# Altium schematic sheet 1_P1.schdoc
size 309 x 223 mm; Symbol: Sheet-Symbol_A4; Device: Sheet-Symbol_A4; @Page Name: P1; @Create Date: 2023-06-01; @Page Count: 1; @Page No: 1; @Project Name: FDC2214; @Schematic Name: Schematic_Break; @Update Date: 2023-06-01; Company: 嘉立创EDA; Page Size: A4; Version: V1.0
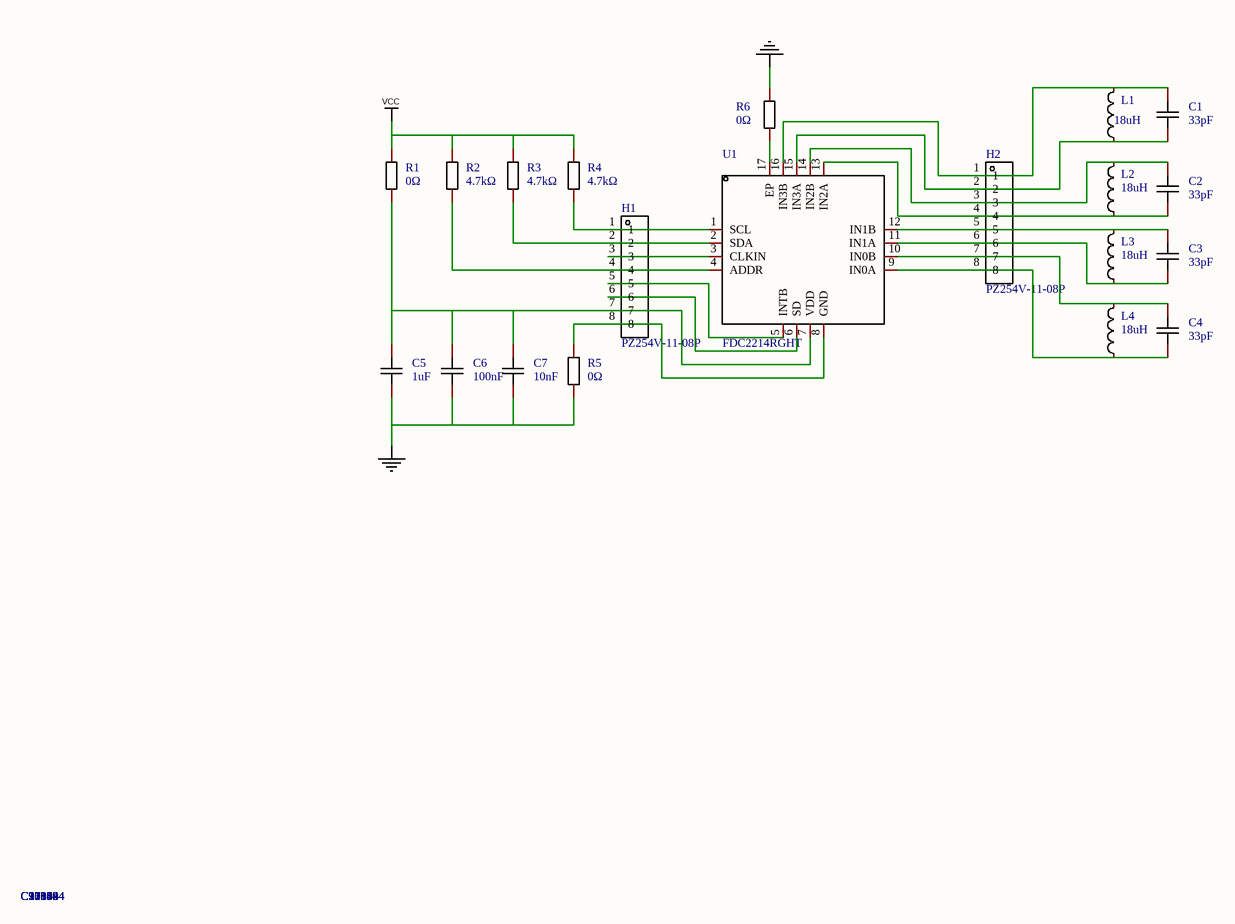
[diagram p0: 1_P1.schdoc]

## Parts
C1  Supplier Part: C91368  [C0603]  (hidden comment: 33pF)
C2  Supplier Part: C91368  [C0603]  (hidden comment: 33pF)
C3  Supplier Part: C91368  [C0603]  (hidden comment: 33pF)
C4  Supplier Part: C91368  [C0603]  (hidden comment: 33pF)
C5  Supplier Part: C15849  [C0603]  (hidden comment: 1uF)
C6  100nF  [C0603]
C7  Supplier Part: C57112  [C0603]  (hidden comment: 10nF)
H1  PZ254V-11-08P  [HDR-TH_8P-P2.54-V-M]
H2  PZ254V-11-08P  [HDR-TH_8P-P2.54-V-M]
L1  Supplier Part: C57839  [L0603]  (hidden comment: 18uH)
L2  Supplier Part: C57839  [L0603]  (hidden comment: 18uH)
L3  Supplier Part: C57839  [L0603]  (hidden comment: 18uH)
L4  Supplier Part: C57839  [L0603]  (hidden comment: 18uH)
R1  Supplier Part: C100044  [R0603]  (hidden comment: 0Ω)
R2  Supplier Part: C23162  [R0603]  (hidden comment: 4.7kΩ)
R3  Supplier Part: C23162  [R0603]  (hidden comment: 4.7kΩ)
R4  Supplier Part: C23162  [R0603]  (hidden comment: 4.7kΩ)
R5  Supplier Part: C100044  [R0603]  (hidden comment: 0Ω)
R6  Supplier Part: C100044  [R0603]  (hidden comment: 0Ω)
U1  FDC2214RGHT  [WQFN-16_L4.1-W4.1-P0.50-LS4.1-BL]

## Nets
NetC5_1: C5.1 C6.1 C7.1 R5.1 R6.2
VCC: R1.2 R2.2 R3.2 R4.2
NetC1_1: C1.1 H2.2 L1.1 U1.15(IN3A)
NetC1_2: C1.2 H2.1 L1.2 U1.16(IN3B)
NetC2_1: C2.1 H2.4 L2.1 U1.13(IN2A)
NetC2_2: C2.2 H2.3 L2.2 U1.14(IN2B)
NetC3_1: C3.1 H2.6 L3.1 U1.11(IN1A)
NetC3_2: C3.2 H2.5 L3.2 U1.12(IN1B)
NetC4_1: C4.1 H2.8 L4.1 U1.9(IN0A)
NetC4_2: C4.2 H2.7 L4.2 U1.10(IN0B)
NetC5_2: C5.2 C6.2 C7.2 H1.7 R1.1 U1.7(VDD)
NetH1_1: H1.1 R4.1 U1.1(SCL)
NetH1_2: H1.2 R3.1 U1.2(SDA)
NetH1_3: H1.3 U1.3(CLKIN)
NetH1_4: H1.4 R2.1 U1.4(ADDR)
NetH1_5: H1.5 U1.5(INTB)
NetH1_6: H1.6 U1.6(SD)
NetH1_8: H1.8 R5.2 U1.8(GND)
NetR6_1: R6.1 U1.17(EP)

## Notes on the sheet
- 1
- 2
- 3
- 4
- 5
- 6
- A
- B
- C
- Schematic
- Schematic_Break
- Create Date
- Update Date
- 2023-06-01
- Reviewed
- Drawed
- Page
- P1
- Part Number
- FDC2214
- D
- VER
- SIZE
- PAGE
- OF
- V1.0
- A4
- 嘉立创EDA

## Library data of the parts
C1-C4 = 0603CG330J500NT: 容值:33pF;精度:±5%;额定电压:50V;材质(温度系数):C0G;; Manufacturer: FH(风华); Add into BOM: yes; Tolerance: ±5%; Voltage Rated: 50V; Temperature Coefficient: C0G; Name: 33pF; Symbol: 0603CG330J500NT; Device: 0603CG330J500NT; LCSC Part Name: 33pF ±5% 50V; Manufacturer Part: 0603CG330J500NT; Supplier Footprint: 0603; JLCPCB Part Class: Extended Part; Datasheet: https://atta.szlcsc.com/upload/public/pdf/source/20170923/C91368_1506149566728988976.pdf; Supplier: LCSC; Convert to PCB: yes; Value: 33pF
C5 = CL10A105KB8NNNC: 容值:1uF;精度:±10%;额定电压:50V;材质(温度系数):X5R;; Manufacturer: SAMSUNG(三星); Add into BOM: yes; Tolerance: ±10%; Voltage Rated: 50V; Temperature Coefficient: X5R; Name: 1uF; Symbol: CL10A105KB8NNNC; Device: CL10A105KB8NNNC; LCSC Part Name: 1uF ±10% 50V; Manufacturer Part: CL10A105KB8NNNC; Supplier Footprint: 0603; JLCPCB Part Class: Basic Part; Datasheet: https://atta.szlcsc.com/upload/public/pdf/source/20160103/1457707679084.pdf; Supplier: LCSC; Convert to PCB: yes; Value: 1uF
C6 = CC0603KRX7R9BB104: 容值:100nF;精度:±10%;额定电压:50V;材质(温度系数):X7R;; Manufacturer: YAGEO(国巨); Add into BOM: yes; Tolerance: ±10%; Voltage Rated: 50V; Temperature Coefficient: X7R; Name: 100nF; Symbol: CC0603KRX7R9BB104; Device: CC0603KRX7R9BB104; LCSC Part Name: 100nF ±10% 50V; Supplier Part: C14663; Manufacturer Part: CC0603KRX7R9BB104; Supplier Footprint: 0603; JLCPCB Part Class: Basic Part; Datasheet: https://atta.szlcsc.com/upload/public/pdf/source/20180910/C282072_33301C7F631E79921B82A8DAC6BCC5B3.pdf; Supplier: LCSC; Convert to PCB: yes; Value: 100nF
C7 = 0603B103K500NT: 容值:10nF;精度:±10%;额定电压:50V;材质(温度系数):X7R;; Manufacturer: FH(风华); Add into BOM: yes; Tolerance: ±10%; Voltage Rated: 50V; Temperature Coefficient: X7R; Name: 10nF; Symbol: 0603B103K500NT; Device: 0603B103K500NT; LCSC Part Name: 10nF ±10% 50V; Manufacturer Part: 0603B103K500NT; Supplier Footprint: 0603; JLCPCB Part Class: Basic Part; Datasheet: https://atta.szlcsc.com/upload/public/pdf/source/20170923/C57112_1506149495135988846.pdf; Supplier: LCSC; Convert to PCB: yes; Value: 10nF
H1 H2 = PZ254V-11-08P: 排数:单排;总PIN位数:8;间距:2.54mm;插针结构:1x8P;行距:-;安装类型:直插;圆针/方针:方针;额定电流:-;额定电压:-;配合针长度:6mm;塑高:2.5mm;端接针长度:3mm;触头材质:黄铜;触头镀层:-;工作温度范围:-40℃~+105℃;颜色:黑色;; Manufacturer: XFCN(兴飞); Add into BOM: yes; Pitch: 2.54mm; Pin Structure: 1x8P; Circluar Pins/Square Pins: 方针; Name: PZ254V-11-08P; Symbol: PZ254V-11-08P; Device: PZ254V-11-08P; LCSC Part Name: 2.54mm 1x8P 直插 方针; Supplier Part: C492407; Manufacturer Part: PZ254V-11-08P; Supplier Footprint: 直插,P=2.54mm; JLCPCB Part Class: Extended Part; Datasheet: https://atta.szlcsc.com/upload/public/pdf/source/20200309/C492407_83A6FB26A2233368EDB9516968EC6149.pdf; Supplier: LCSC; Convert to PCB: yes; Number of Rows: 单排; Number of Pins: 8; Row Spacing: -; Mounting Type: 直插; Current Rating (Max): -; Voltage Rating (Max): -; Length of Mating Pin: 6mm; Insulation Height: 2.5mm; Length of End Connection Pin: 3mm; Contact Material: 黄铜; Contact Plating: -; Operating Temperature Range: -40℃~+105℃; Color: 黑色
L1-L4 = SDFL1608T180KTF: 电感值:18uH;精度:±10%;额定电流:1mA;饱和电流(Isat):-;直流电阻(DCR):1.85Ω;; Manufacturer: Sunlord(顺络); Add into BOM: yes; Tolerance: ±10%; Rated Current: 1mA; DC Resistance (DCR): 1.85Ω; Q @ Freq: 20@1MHz; Frequency - Self Resonant: 1MHz; Name: 18uH; Symbol: SDFL1608T180KTF; Device: SDFL1608T180KTF; LCSC Part Name: 18uH ±10%; Manufacturer Part: SDFL1608T180KTF; Supplier Footprint: 0603; JLCPCB Part Class: Extended Part; Datasheet: https://atta.szlcsc.com/upload/public/pdf/source/20210816/855F4348312D259031B87CBCF31BE802.pdf; Supplier: LCSC; Convert to PCB: yes; Value: 18uH; Saturation Current (Isat): -; Ratings: -
R1 R5 R6 = RC0603FR-070RL: 电阻类型:厚膜电阻;阻值:0Ω;精度:-;功率:100mW;; Manufacturer: YAGEO(国巨); Add into BOM: yes; Power(Watts): 100mW; Overload Voltage (Max): 75V; Name: 0Ω; Symbol: RC0603FR-070RL; Device: RC0603FR-070RL; LCSC Part Name: 0Ω 100mW; Manufacturer Part: RC0603FR-070RL; Supplier Footprint: 0603; JLCPCB Part Class: Extended Part; Datasheet: https://atta.szlcsc.com/upload/public/pdf/source/20170620/1497944725236.pdf; Supplier: LCSC; Convert to PCB: yes; Type: 厚膜电阻; Value: 0Ω; Tolerance: -; Temperature Coefficient: -; Operating Temperature Range: -55℃~+155℃
R2-R4 = 0603WAF4701T5E: 电阻类型:厚膜电阻;阻值:4.7kΩ;精度:±1%;功率:100mW;; Manufacturer: UNI-ROYAL(厚声); Add into BOM: yes; Tolerance: ±1%; Power(Watts): 100mW; Temperature Coefficient: ±100ppm/℃; Overload Voltage (Max): 75V; Name: 4.7kΩ; Symbol: 0603WAF4701T5E; Device: 0603WAF4701T5E; LCSC Part Name: 4.7kΩ ±1% 100mW; Manufacturer Part: 0603WAF4701T5E; Supplier Footprint: 0603; JLCPCB Part Class: Basic Part; Datasheet: https://atta.szlcsc.com/upload/public/pdf/source/20200306/C422600_1E6D84923E4A46A82E41ADD87F860B5C.pdf; Supplier: LCSC; Convert to PCB: yes; Type: 厚膜电阻; Value: 4.7kΩ; Operating Temperature Range: -55℃~+155℃
U1 = FDC2214RGHT: FDC2214 FDC2112 FDC2114; Manufacturer: TI(德州仪器); Add into BOM: yes; Name: FDC2214RGHT; Symbol: FDC2214RGHT; Device: FDC2214RGHT; LCSC Part Name: FDC2214RGHT; Supplier Part: C195016; Manufacturer Part: FDC2214RGHT; Supplier Footprint: WQFN-16(4.1x4.1); JLCPCB Part Class: Extended Part; Datasheet: https://atta.szlcsc.com/upload/public/pdf/source/20180625/C195016_087E6490787A2A67FC634521D801753A.pdf; Supplier: LCSC; Convert to PCB: yes